# EAGLE design unt9833VCO pots jacks 1-29-23 (EAGLE 9.6.2)
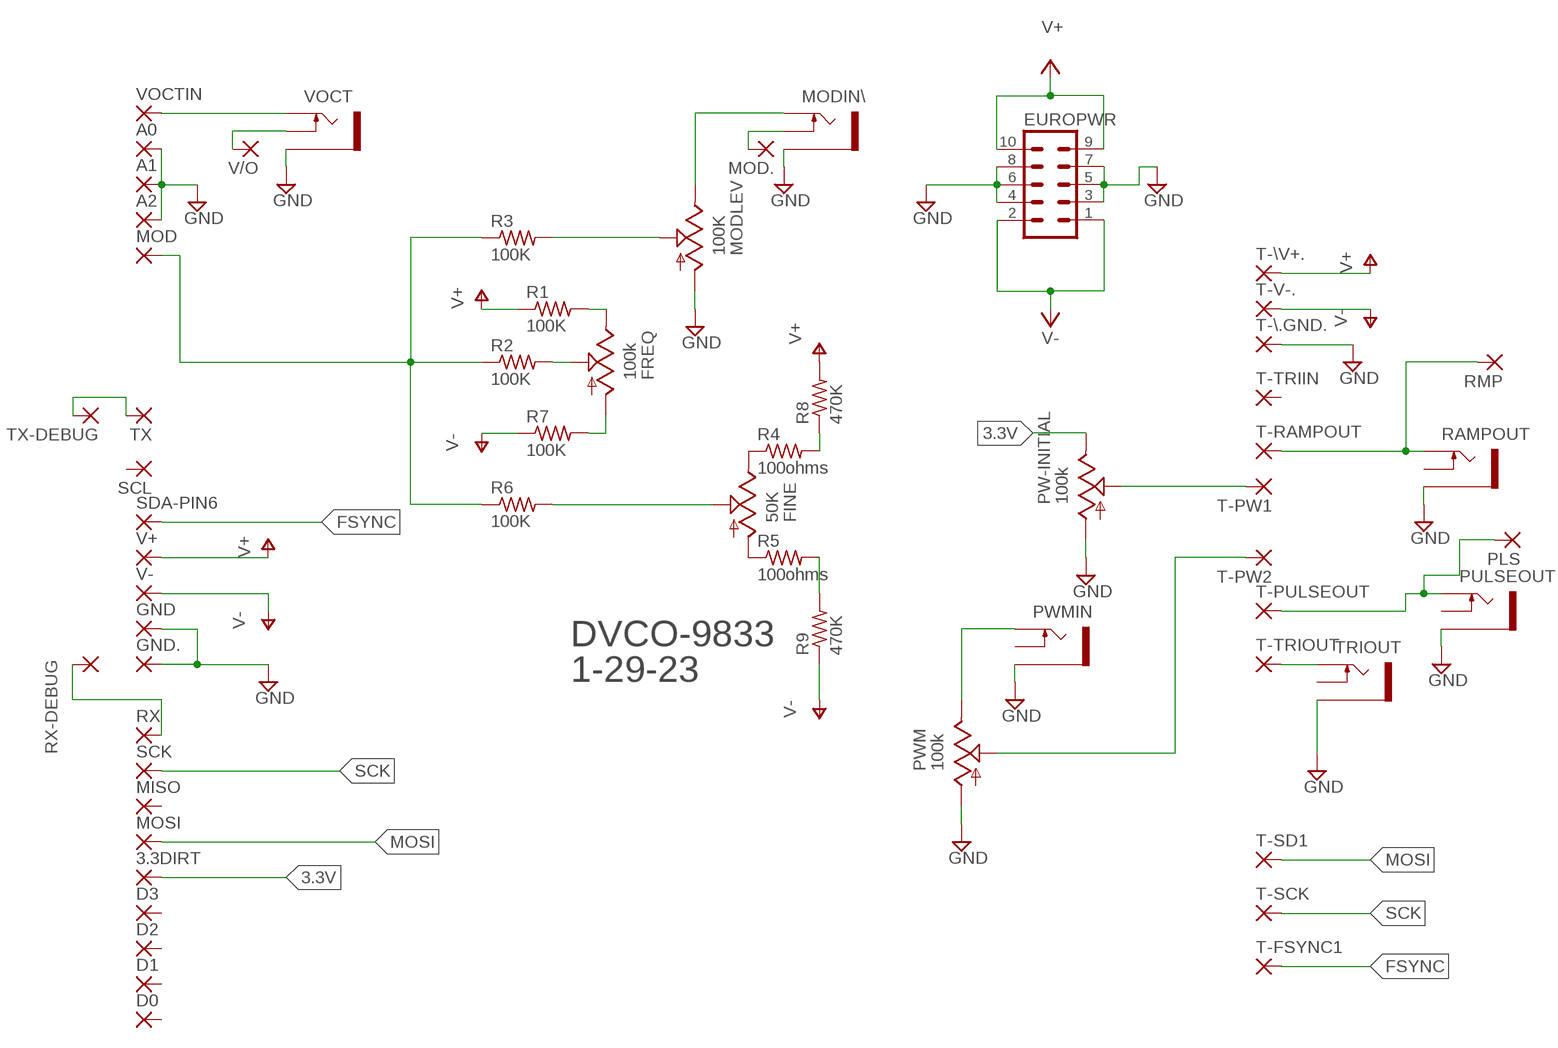
[diagram p0: schematic, sheet 1]

## Parts
3.3DIRT  WIREPAD1,6/0,9  [1,6/0,9]
A0  WIREPAD1,6/0,9  [1,6/0,9]
A1  WIREPAD1,6/0,9  [1,6/0,9]
A2  WIREPAD1,6/0,9  [1,6/0,9]
D0  WIREPAD1,6/0,9  [1,6/0,9]
D1  WIREPAD1,6/0,9  [1,6/0,9]
D2  WIREPAD1,6/0,9  [1,6/0,9]
D3  WIREPAD1,6/0,9  [1,6/0,9]
EUROPWR  EURO_POWER_HEADERREGULAR  [EURO_POWER_HEADER]
FINE  50K  9MM_SNAP-IN_POT_  [9MM_SNAP-IN_POT]
FREQ  100k  9MM_SNAP-IN_POT_  [9MM_SNAP-IN_POT]
GND  WIREPAD1,6/0,9  [1,6/0,9]
GND.  WIREPAD1,6/0,9  [1,6/0,9]
MISO  WIREPAD1,6/0,9  [1,6/0,9]
MOD  WIREPAD1,6/0,9  [1,6/0,9]
MOD.  WIREPAD1,6/0,9  [1,6/0,9]
MODIN\  THONKICONNNEW  [WQP-PJ301M-12_JACK]
MODLEV  100K  9MM_SNAP-IN_POT_  [9MM_SNAP-IN_POT]
MOSI  WIREPAD1,6/0,9  [1,6/0,9]
PLS  WIREPAD1,6/0,9  [1,6/0,9]
PULSEOUT  THONKICONNNEW  [WQP-PJ301M-12_JACK]
PW-INITIAL  100k  9MM_SNAP-IN_POT_  [9MM_SNAP-IN_POT]
PWM  100k  9MM_SNAP-IN_POT_  [9MM_SNAP-IN_POT]
PWMIN  THONKICONNNEW  [WQP-PJ301M-12_JACK]
R1  100K  R-US_0204/7  [0204/7]
R2  100K  R-US_0207/15  [0207/15]
R3  100K  R-US_0207/15  [0207/15]
R4  100ohms  R-US_0207/15  [0207/15]
R5  100ohms  R-US_0207/15  [0207/15]
R6  100K  R-US_0207/15  [0207/15]
R7  100K  R-US_0204/7  [0204/7]
R8  470K  R-US_0204/7  [0204/7]
R9  470K  R-US_0204/7  [0204/7]
RAMPOUT  THONKICONNNEW  [WQP-PJ301M-12_JACK]
RMP  WIREPAD1,6/0,9  [1,6/0,9]
RX  WIREPAD1,6/0,9  [1,6/0,9]
RX-DEBUG  WIREPAD1,6/0,9  [1,6/0,9]
SCK  WIREPAD1,6/0,9  [1,6/0,9]
SCL  WIREPAD1,6/0,9  [1,6/0,9]
SDA-PIN6  WIREPAD1,6/0,9  [1,6/0,9]
T-\.GND.  WIREPAD1,6/0,9  [1,6/0,9]
T-\V+.  WIREPAD1,6/0,9  [1,6/0,9]
T-FSYNC1  WIREPAD1,6/0,9  [1,6/0,9]
T-PULSEOUT  WIREPAD1,6/0,9  [1,6/0,9]
T-PW1  WIREPAD1,6/0,9  [1,6/0,9]
T-PW2  WIREPAD1,6/0,9  [1,6/0,9]
T-RAMPOUT  WIREPAD1,6/0,9  [1,6/0,9]
T-SCK  WIREPAD1,6/0,9  [1,6/0,9]
T-SD1  WIREPAD1,6/0,9  [1,6/0,9]
T-TRIIN  WIREPAD1,6/0,9  [1,6/0,9]
T-TRIOUT  WIREPAD1,6/0,9  [1,6/0,9]
T-V-.  WIREPAD1,6/0,9  [1,6/0,9]
TRIOUT  THONKICONNNEW  [WQP-PJ301M-12_JACK]
TX  WIREPAD1,6/0,9  [1,6/0,9]
TX-DEBUG  WIREPAD1,6/0,9  [1,6/0,9]
V+  WIREPAD1,6/0,9  [1,6/0,9]
V-  WIREPAD1,6/0,9  [1,6/0,9]
V/O  WIREPAD1,6/0,9  [1,6/0,9]
VOCT  THONKICONNNEW  [WQP-PJ301M-12_JACK]
VOCTIN  WIREPAD1,6/0,9  [1,6/0,9]

## Nets
3.3V: 3.3DIRT.1(P) PW-INITIAL.3(E)
FSYNC: SDA-PIN6.1(P) T-FSYNC1.1(P)
GND: A0.1(P) A1.1(P) A2.1(P) EUROPWR.3 EUROPWR.4 EUROPWR.5 EUROPWR.6 EUROPWR.7 EUROPWR.8 GND.1(P) GND..1(P) MODIN\.P$3_SLEEVE(SLEEVE) MODLEV.1(A) PULSEOUT.P$3_SLEEVE(SLEEVE) PW-INITIAL.1(A) PWM.1(A) PWMIN.P$3_SLEEVE(SLEEVE) RAMPOUT.P$3_SLEEVE(SLEEVE) T-\.GND..1(P) TRIOUT.P$3_SLEEVE(SLEEVE) VOCT.P$3_SLEEVE(SLEEVE)
MOSI: MOSI.1(P) T-SD1.1(P)
N$1: VOCT.P$1_TIP(TIP) VOCTIN.1(P)
N$2: MOD.1(P) R2.1 R3.1 R6.1
N$3: MODIN\.P$1_TIP(TIP) MODLEV.3(E)
N$4: MOD..1(P) MODIN\.P$2_SWITCH(SWITCH)
N$5: MODLEV.2(S) R3.2
N$6: FINE.3(E) R4.1
N$7: FINE.1(A) R5.1
N$8: FINE.2(S) R6.2
N$9: FREQ.2(S) R2.2
N$10: PLS.1(P) PULSEOUT.P$1_TIP(TIP) T-PULSEOUT.1(P)
N$11: T-TRIOUT.1(P) TRIOUT.P$1_TIP(TIP)
N$12: FREQ.3(E) R1.2
N$13: PW-INITIAL.2(S) T-PW1.1(P)
N$14: PWM.2(S) T-PW2.1(P)
N$15: PWM.3(E) PWMIN.P$1_TIP(TIP)
N$16: V/O.1(P) VOCT.P$2_SWITCH(SWITCH)
N$17: TX-DEBUG.1(P) TX.1(P)
N$18: FREQ.1(A) R7.2
N$19: RX-DEBUG.1(P) RX.1(P)
N$20: R5.2 R9.2
N$21: R4.2 R8.1
RMP>: RAMPOUT.P$1_TIP(TIP) RMP.1(P) T-RAMPOUT.1(P)
SCK: SCK.1(P) T-SCK.1(P)
V+: EUROPWR.9 EUROPWR.10 R1.1 R8.2 T-\V+..1(P) V+.1(P)
V-: EUROPWR.1 EUROPWR.2 R7.1 R9.1 T-V-..1(P) V-.1(P)
Unconnected: D0.1(P) D1.1(P) D2.1(P) D3.1(P) MISO.1(P) PULSEOUT.P$2_SWITCH(SWITCH) PWMIN.P$2_SWITCH(SWITCH) RAMPOUT.P$2_SWITCH(SWITCH) SCL.1(P) T-TRIIN.1(P) TRIOUT.P$2_SWITCH(SWITCH)

## Notes on the sheet
- DVCO-9833
- 1-29-23

## Library data of the parts
3.3DIRT A0 A1 A2 D0 D1-D3 GND GND. MISO MOD MOD. MOSI PLS RMP RX RX-DEBUG SCK SCL SDA-PIN6 T-\.GND. T-\V+. T-FSYNC1 T-PULSEOUT T-PW1 T-PW2 T-RAMPOUT T-SCK T-SD1 T-TRIIN T-TRIOUT T-V-. TX TX-DEBUG V+ V- V/O VOCTIN = wirepad:WIREPAD: Wire PAD connect wire on PCB
EUROPWR = MusicThingModular:EURO_POWER_HEADER: Power Header 10 pin power header for Eurorack Power Supplies Variants with fatter pads for easier soldering, and the LOCK variant which has 5mil offset pins to hold the component in place before soldering
FINE FREQ MODLEV PW-INITIAL PWM = MusicThingModular:9MM_SNAP-IN_POT: 9mm vertical snap-in pot, Alpha / Panasonic style
MODIN\ PULSEOUT PWMIN RAMPOUT TRIOUT VOCT = MusicThingModular:THONKICONN: 3.5mm socket for Eurorack modular synths
R1-R9 = rcl:R-US_: RESISTOR, American symbol; SPICEPREFIX: R

## Board
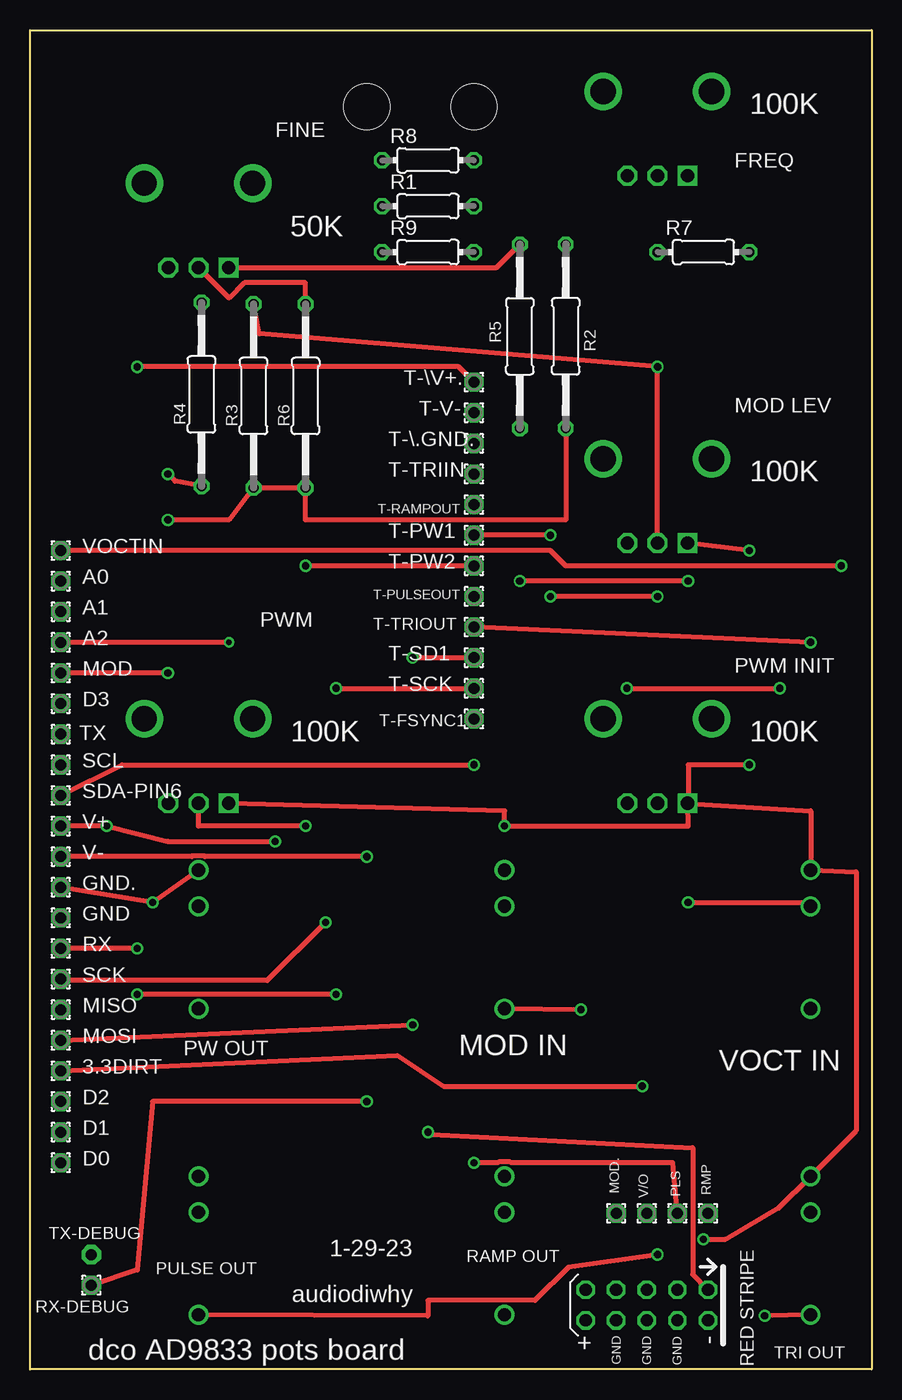
[diagram p1: board, top side]
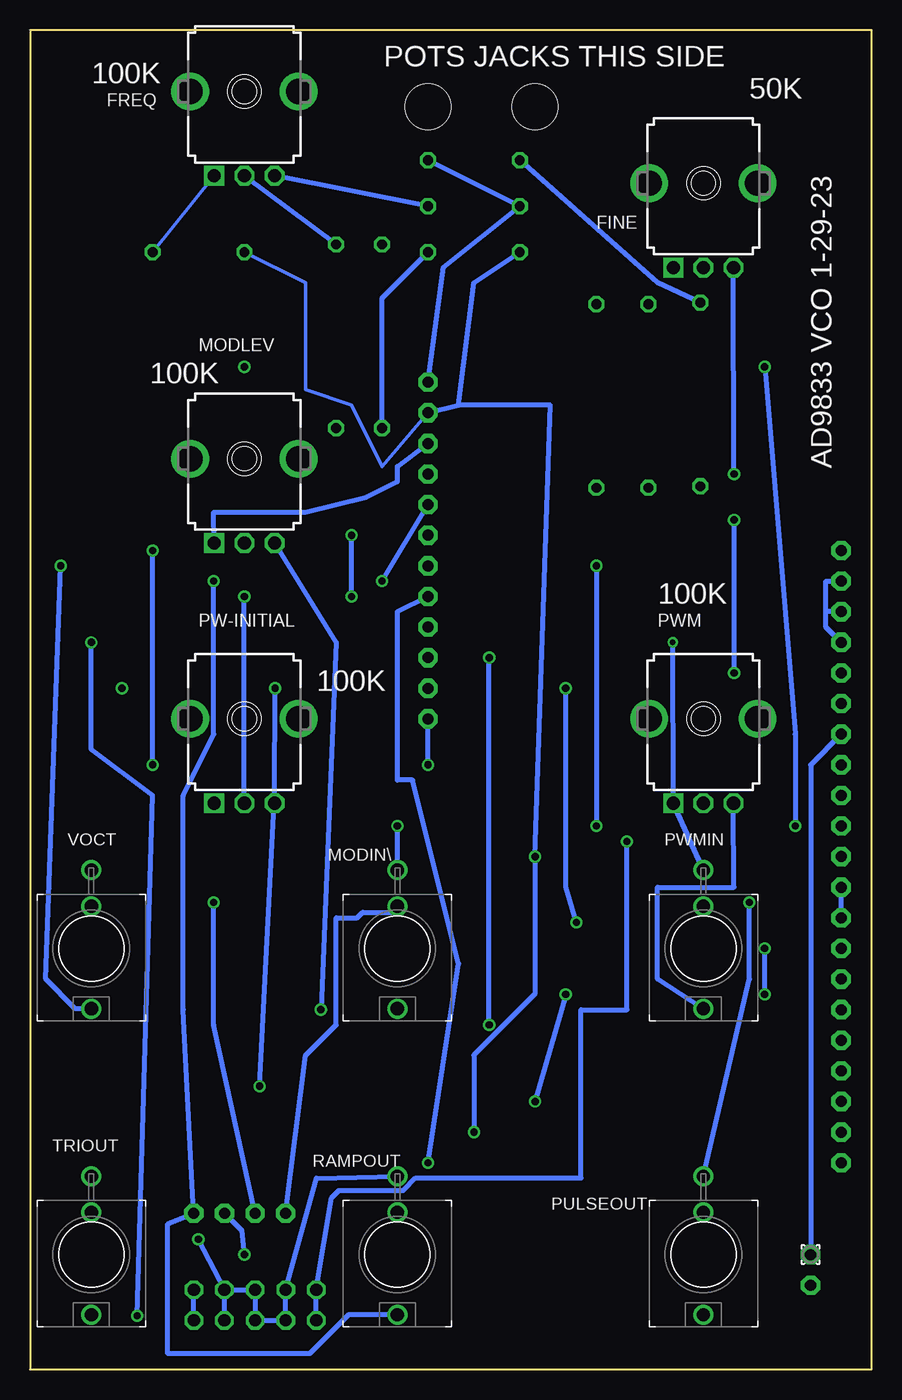
[diagram p2: board, bottom side, seen from below]

Size 69.85 x 111.12 mm. Coordinates in mm from the lower left corner, seen from the top.
Outline: 0,0 0,111.12 69.85,111.12 69.85,0 0,0
Copper layers (1*16): Top 0.035mm / dielectric 1.5mm / Bottom 0.035mm
Design rules "default": minimum track width 6mil, minimum drill 0.35mm, track to track 6mil, track to pad 6mil, pad to pad 6mil, via to via 6mil, smd to smd 6mil, copper to edge 40mil, drill to drill 6mil, minimum pad ring 10mil, minimum via ring 8mil, stop-mask expansion 4mil, vias tented up to drill 0mil, thermal gap 10mil
Holes 3.81 mm at 27.94,104.78 36.83,104.78

### Footprints (pad centres in the part's own frame; a part is rotated, then mirrored left to right if it is on the bottom)
1,6/0,9 = drill 0.914 pad 1.6 octagon: 1 0,0
EURO_POWER_HEADER = drill 1.016 octagon: 1 -5.08,-1.27; 2 -5.08,1.27; 3 -2.54,-1.27; 4 -2.54,1.27; 5 0,-1.27; 6 0,1.27; 7 2.54,-1.27; 8 2.54,1.27; 9 5.08,-1.27; 10 5.08,1.27
9MM_SNAP-IN_POT = drill 1.1 square: 1 -2.5,-7 | drill 1.1 octagon: 2 0,-7; 3 2.5,-7 | drill 2.1 pad 2.794: CHASSIS1 -4.5,0; CHASSIS2 4.5,0
WQP-PJ301M-12_JACK = drill 1.1: P$1_TIP 0,5; P$2_SWITCH 0,-3.5; P$3_SLEEVE 0,-6.5
0204/7 = drill 0.813 octagon: 1 -3.81,0; 2 3.81,0
0207/15 = drill 0.813 octagon: 1 -7.62,0; 2 7.62,0

### Placement (x,y rotation side)
3.3DIRT  2.54,24.77 0 top
A0  2.54,65.41 0 top
A1  2.54,62.87 0 top
A2  2.54,60.33 0 top
D0  2.54,17.14 0 top
D1  2.54,19.68 0 top
D2  2.54,22.23 0 top
D3  2.54,55.24 0 top
EUROPWR  51.18,5.33 180 top
FINE  13.97,98.42 0 bottom
FREQ  52.07,106.05 0 bottom
GND  2.54,37.47 0 top
GND.  2.54,40.01 0 top
MISO  2.54,29.84 0 top
MOD  2.54,57.78 0 top
MOD.  48.64,12.95 90 top
MODIN\  39.37,34.92 180 bottom
MODLEV  52.07,75.56 0 bottom
MOSI  2.54,27.3 0 top
PLS  53.72,12.95 90 top
PULSEOUT  13.97,9.53 180 bottom
PW-INITIAL  52.07,53.98 0 bottom
PWM  13.97,53.98 0 bottom
PWMIN  13.97,34.92 180 bottom
R1  33.02,96.52 0 top
R2  44.45,85.72 90 top
R3  18.54,80.77 90 top
R4  14.22,80.9 90 top
R5  40.64,85.72 270 top
R6  22.86,80.77 90 top
R7  55.88,92.71 0 top
R8  33.02,100.33 0 top
R9  33.02,92.71 0 top
RAMPOUT  39.37,9.53 180 bottom
RMP  56.26,12.95 90 top
RX  2.54,34.92 0 top
RX-DEBUG  5.08,6.99 0 top
SCK  2.54,32.38 0 top
SCL  2.54,50.16 0 top
SDA-PIN6  2.54,47.62 0 top
T-\.GND.  36.83,76.83 0 top
T-\V+.  36.83,81.92 0 top
T-FSYNC1  36.83,53.98 0 top
T-PULSEOUT  36.83,64.14 0 top
T-PW1  36.83,69.22 0 top
T-PW2  36.83,66.67 0 top
T-RAMPOUT  36.83,71.75 0 top
T-SCK  36.83,56.52 0 top
T-SD1  36.83,59.05 0 top
T-TRIIN  36.83,74.3 0 top
T-TRIOUT  36.83,61.59 0 top
T-V-.  36.83,79.38 0 top
TRIOUT  64.77,9.53 180 bottom
TX  2.54,52.7 0 top
TX-DEBUG  5.08,9.53 0 bottom
V+  2.54,45.09 0 top
V-  2.54,42.55 0 top
V/O  51.18,12.95 90 top
VOCT  64.77,34.92 180 bottom
VOCTIN  2.54,67.94 0 top

### Tracks (layer width: path | path; a pad name or v marks a point on that pad's centre or on a via)
3.3V  (via drill 0.6)
  Top 0.406: v49.53,56.52 v62.23,56.52 | 3.3DIRT.1 30.48,26.04 34.29,23.5 v50.8,23.5
  Bottom 0.406: PW-INITIAL.3 49.57,47.62 | 49.57,47.62 v49.53,56.52 | v50.8,23.5 49.57,47.62
FSYNC  (via drill 0.6)
  Top 0.406: SDA-PIN6.1 7.62,50.16 v36.83,50.16
  Bottom 0.406: v36.83,50.16 T-FSYNC1.1
GND  (via drill 0.45, 0.6)
  Top 0.406: PW-INITIAL.1 64.77,46.35 VOCT.P$3_SLEEVE 68.56,41.27 68.56,19.81 TRIOUT.P$3_SLEEVE 62.14,13.39 57.72,10.79 v55.88,10.79 | PW-INITIAL.1 54.61,45.09 v39.37,45.09 39.37,46.35 PWM.1 | v16.51,60.33 A2.1 | PWMIN.P$3_SLEEVE v10.16,38.73 GND..1 | v59.69,50.16 54.61,50.16 54.61,47.62 PW-INITIAL.1 | v59.69,67.94 MODLEV.1
  Bottom 0.406: v59.69,50.16 v59.69,67.94 | MODIN\.P$3_SLEEVE v39.37,45.09 | PWMIN.P$3_SLEEVE PWM.1 v16.51,60.33 | PULSEOUT.P$3_SLEEVE 10.16,32.38 v10.16,38.73 | EUROPWR.4 EUROPWR.3 | EUROPWR.3 EUROPWR.5 EUROPWR.6 EUROPWR.8 EUROPWR.7 46.08,15.87 RAMPOUT.P$3_SLEEVE | EUROPWR.3 55.88,10.7 v55.88,10.79 | GND.1 GND..1 | A2.1 3.81,61.59 3.81,62.87 | 3.81,62.87 3.81,65.41 A0.1 | A1.1 3.81,62.87 | MODLEV.1 54.61,71.12 46.99,71.12 41.91,72.39 39.37,73.66 39.37,74.93 T-\.GND..1
MOSI  (via drill 0.6)
  Top 0.406: MOSI.1 v31.75,28.57 | v31.75,59.05 T-SD1.1
  Bottom 0.406: v31.75,28.57 v31.75,59.05
N$1  (via drill 0.6)
  Top 0.406: v67.31,66.67 44.45,66.67 43.18,67.94 VOCTIN.1
  Bottom 0.406: VOCT.P$1_TIP 66.09,29.93 68.56,32.38 v67.31,66.67
N$2  (via drill 0.6)
  Top 0.406: v11.43,70.48 16.51,70.48 R3.1 R6.1 22.86,70.48 44.45,70.48 R2.1 | v11.43,57.78 MOD.1
  Bottom 0.406: v11.43,70.48 v11.43,57.78
N$3  (via drill 0.6)
  Top 0.406: v45.72,29.84 MODIN\.P$1_TIP
  Bottom 0.406: MODLEV.3 44.45,60.33 v45.72,29.84
N$4
  Bottom 0.406: MOD..1 46.99,26.04 44.45,28.57 44.45,37.47 42.72,37.47 42.25,37.93 39.87,37.93 MODIN\.P$2_SWITCH
N$5  (via drill 0.6)
  Top 0.406: MODLEV.2 v52.07,83.19 19.01,85.94 R3.2
N$6  (via drill 0.6)
  Top 0.406: R4.1 12.03,73.7 v11.43,74.3
  Bottom 0.406: v11.43,74.3 FINE.3
N$7
  Top 0.406: FINE.1 38.72,91.42 R5.1
N$8
  Top 0.406: R6.2 22.86,90.17 17.78,90.17 16.51,88.9 FINE.2
N$9
  Bottom 0.406: R2.2 FREQ.2
N$10  (via drill 0.6)
  Top 0.406: v52.07,9.53 44.66,8.47 41.91,5.71 33.02,5.71 33.02,4.45 PULSEOUT.P$1_TIP | PLS.1 53.34,17.14 39.92,17.14 39.86,17.21 38.88,17.21 38.82,17.14 v36.83,17.14
  Bottom 0.406: PLS.1 52.29,11.53 v52.07,9.53 | v36.83,17.14 34.29,33.66 38.1,48.9 39.37,48.9 39.37,62.87 T-PULSEOUT.1
N$11  (via drill 0.6)
  Top 0.406: TRIOUT.P$1_TIP v60.96,4.45 | v64.77,60.33 T-TRIOUT.1
  Bottom 0.406: v60.96,4.45 59.69,47.62 64.77,51.44 v64.77,60.33
N$12
  Bottom 0.406: R1.2 FREQ.3
N$13  (via drill 0.6)
  Top 0.406: v52.07,64.14 v43.18,64.14 | v43.18,69.22 T-PW1.1
  Bottom 0.406: PW-INITIAL.2 v52.07,64.14 | v43.18,64.14 v43.18,69.22
N$14  (via drill 0.6)
  Top 0.406: T-PW2.1 v22.86,66.67 | v22.86,45.09 13.97,45.09 PWM.2
  Bottom 0.406: v22.86,66.67 v22.86,45.09
N$15
  Bottom 0.406: PWMIN.P$1_TIP 17.78,32.38 17.78,40.01 11.43,40.01 PWM.3
N$16  (via drill 0.6)
  Top 0.406: v54.61,38.73 64.77,38.73 VOCT.P$2_SWITCH
  Bottom 0.406: V/O.1 54.61,28.57 v54.61,38.73
N$17
  Bottom 0.406: TX.1 5.08,50.16 TX-DEBUG.1
N$18
  Bottom 0.305: R7.2 FREQ.1
N$19  (via drill 0.6)
  Top 0.406: v25.4,31.11 v8.89,31.11 | v8.89,34.92 RX.1 | RX-DEBUG.1 8.89,8.26 10.16,22.23 v27.94,22.23
  Bottom 0.406: v8.89,31.11 v8.89,34.92 | v25.4,31.11 v27.94,22.23
N$20
  Bottom 0.406: R5.2 40.64,88.9 R9.2
N$21
  Bottom 0.406: R4.2 17.78,90.17 R8.1
RMP>  (via drill 0.6)
  Top 0.406: v54.61,65.41 v40.64,65.41
  Bottom 0.406: RAMPOUT.P$1_TIP 43.42,4.53 46.65,1.29 58.42,1.29 58.42,12.06 RMP.1 57.15,29.84 57.15,47.62 54.61,52.7 v54.61,65.41 | v40.64,65.41 T-RAMPOUT.1
SCK  (via drill 0.6)
  Top 0.406: SCK.1 2.67,32.26 19.68,32.26 v24.51,37.08 | v25.4,56.52 T-SCK.1
  Bottom 0.406: v24.51,37.08 25.4,40.05 v25.4,56.52
V+  (via drill 0.6)
  Top 0.406: T-\V+..1 35.56,83.19 v8.89,83.19 | V+.1 v6.35,45.09 11.43,43.81 v20.32,43.81
  Bottom 0.406: v8.89,83.19 6.35,52.7 v6.35,45.09 | EUROPWR.10 EUROPWR.9 44.83,14.22 44.21,14.84 38.88,14.84 37.85,15.88 24.13,15.88 24.13,29.84 20.32,29.84 v20.32,43.81 | T-\V+..1 35.56,91.44 R1.1 R8.2
V-  (via drill 0.6)
  Top 0.406: v27.94,42.55 14.52,42.55 14.46,42.61 13.48,42.61 13.42,42.55 V-.1 | v33.02,19.68 33.22,19.48 54.99,18.4 54.99,7.87 EUROPWR.1
  Bottom 0.305: R7.1 46.99,90.17 46.99,81.28 43.18,80.01 40.64,74.93 T-V-..1
  Bottom 0.406: EUROPWR.2 EUROPWR.1 | v33.02,19.68 33.02,26.09 27.97,31.14 27.97,42.52 v27.94,42.55 26.67,80.01 34.29,80.01 | T-V-..1 34.29,80.01 | 34.29,80.01 33.02,90.17 R9.1

### Text on the board
tNames: 100K | FINE | FREQ | 50K | MOD LEV | 100K | PWM | PWM INIT | 100K | 100K | PW OUT | MOD IN | VOCT IN | 1-29-23 | RAMP OUT | PULSE OUT | audiodiwhy | dco AD9833 pots board | TRI OUT
bNames: POTS JACKS THIS SIDE | 100K | 50K | AD9833 VCO 1-29-23 | 100K | 100K | 100K